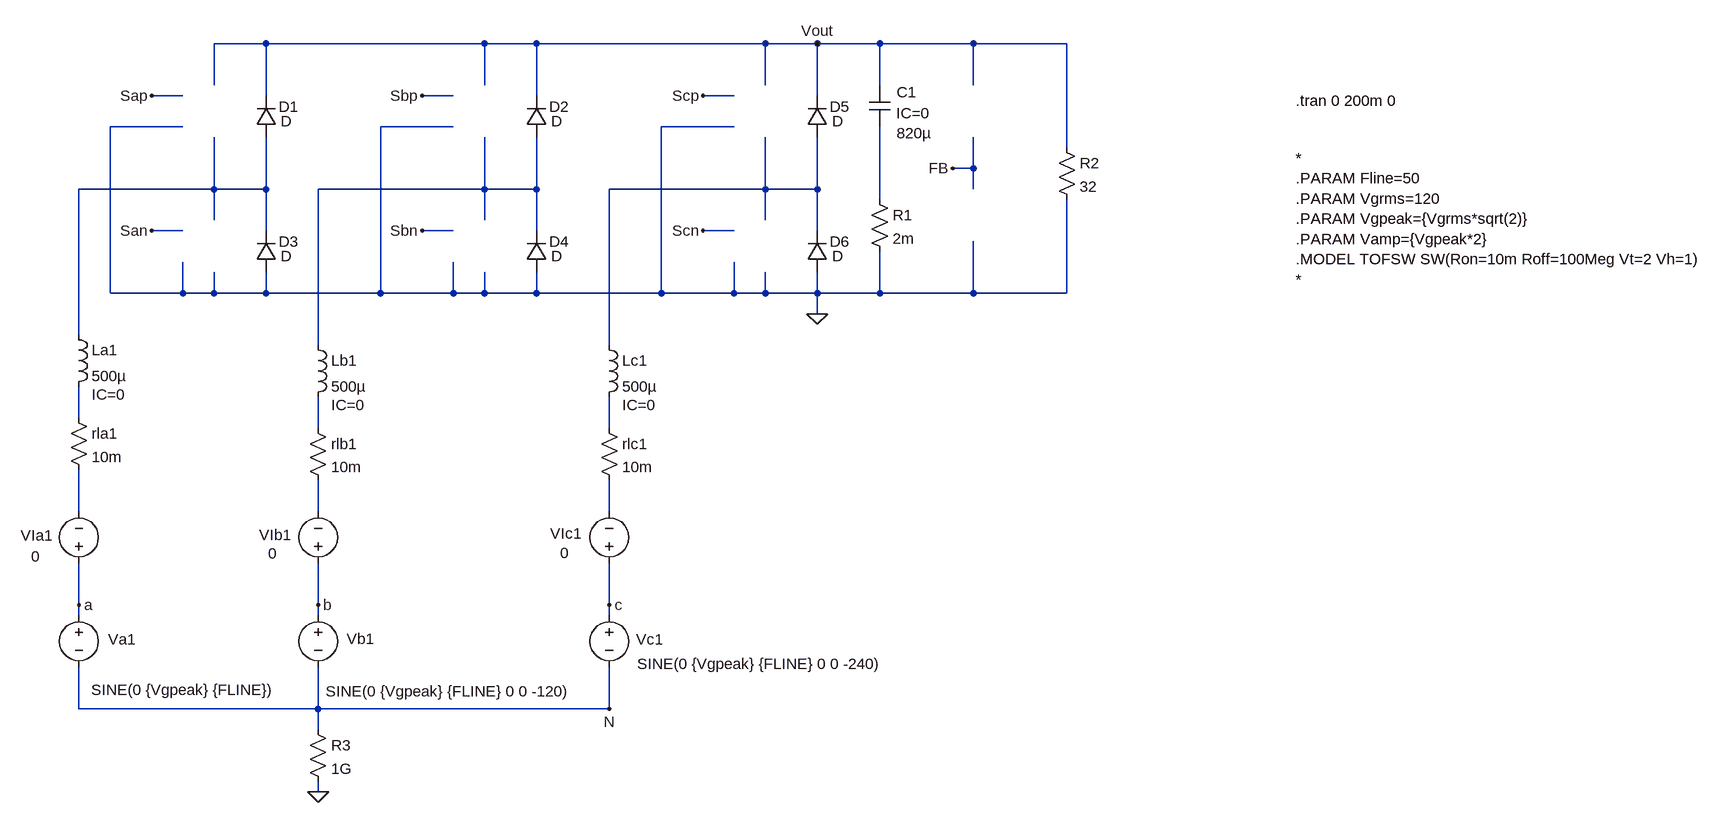
[diagram p0: schematic test 3P rect.asc]
test 3P rect.asc, the LTspice schematic file:
Version 4
SHEET 1 2280 1156
WIRE 32 -16 -48 -16
WIRE 368 -16 32 -16
WIRE 448 -16 368 -16
WIRE 800 -16 448 -16
WIRE 880 -16 800 -16
WIRE 976 -16 880 -16
WIRE 1120 -16 976 -16
WIRE 1264 -16 1120 -16
WIRE -48 48 -48 -16
WIRE 368 48 368 -16
WIRE 800 48 800 -16
WIRE 976 48 976 -16
WIRE 1120 48 1120 -16
WIRE -96 64 -144 64
WIRE 32 64 32 -16
WIRE 320 64 272 64
WIRE 448 64 448 -16
WIRE 752 64 704 64
WIRE 880 64 880 -16
WIRE -96 112 -208 112
WIRE 320 112 208 112
WIRE 752 112 640 112
WIRE 1264 144 1264 -16
WIRE 1120 176 1120 128
WIRE 1120 176 1088 176
WIRE -48 208 -48 128
WIRE -48 208 -256 208
WIRE 32 208 32 128
WIRE 32 208 -48 208
WIRE 368 208 368 128
WIRE 368 208 112 208
WIRE 448 208 448 128
WIRE 448 208 368 208
WIRE 800 208 800 128
WIRE 800 208 560 208
WIRE 880 208 880 128
WIRE 880 208 800 208
WIRE 1120 208 1120 176
WIRE 976 224 976 112
WIRE -48 256 -48 208
WIRE 368 256 368 208
WIRE 800 256 800 208
WIRE -96 272 -144 272
WIRE 32 272 32 208
WIRE 320 272 272 272
WIRE 448 272 448 208
WIRE 752 272 704 272
WIRE 880 272 880 208
WIRE -208 368 -208 112
WIRE -96 368 -96 320
WIRE -96 368 -208 368
WIRE -48 368 -48 336
WIRE -48 368 -96 368
WIRE 32 368 32 336
WIRE 32 368 -48 368
WIRE 208 368 208 112
WIRE 208 368 32 368
WIRE 320 368 320 320
WIRE 320 368 208 368
WIRE 368 368 368 336
WIRE 368 368 320 368
WIRE 448 368 448 336
WIRE 448 368 368 368
WIRE 640 368 640 112
WIRE 640 368 448 368
WIRE 752 368 752 320
WIRE 752 368 640 368
WIRE 800 368 800 336
WIRE 800 368 752 368
WIRE 880 368 880 336
WIRE 880 368 800 368
WIRE 976 368 976 304
WIRE 976 368 880 368
WIRE 1120 368 1120 288
WIRE 1120 368 976 368
WIRE 1264 368 1264 224
WIRE 1264 368 1120 368
WIRE 880 400 880 368
WIRE -256 432 -256 208
WIRE 112 448 112 208
WIRE 560 448 560 208
WIRE -256 560 -256 512
WIRE 112 576 112 528
WIRE 560 576 560 528
WIRE -256 704 -256 640
WIRE 112 704 112 656
WIRE 560 704 560 656
WIRE -256 848 -256 784
WIRE 112 848 112 784
WIRE 560 848 560 784
WIRE -256 864 -256 848
WIRE 112 864 112 848
WIRE 560 864 560 848
WIRE -256 1008 -256 944
WIRE 112 1008 112 944
WIRE 112 1008 -256 1008
WIRE 560 1008 560 944
WIRE 560 1008 112 1008
WIRE 112 1040 112 1008
WIRE 112 1136 112 1120
FLAG -256 848 a
FLAG 112 848 b
FLAG 560 848 c
FLAG -144 64 Sap
FLAG -144 272 San
FLAG 272 64 Sbp
FLAG 272 272 Sbn
FLAG 704 64 Scp
FLAG 704 272 Scn
FLAG 1088 176 FB
FLAG 880 -16 Vout
FLAG 560 1008 N
FLAG 880 400 0
FLAG 112 1136 0
SYMBOL voltage -256 848 R0
WINDOW 0 45 53 Left 2
WINDOW 3 19 131 Left 2
WINDOW 123 0 0 Left 0
WINDOW 39 0 0 Left 0
SYMATTR InstName Va1
SYMATTR Value SINE(0 {Vgpeak} {FLINE})
SYMBOL voltage 112 848 R0
WINDOW 0 44 52 Left 2
WINDOW 3 12 133 Left 2
WINDOW 123 0 0 Left 0
WINDOW 39 0 0 Left 0
SYMATTR InstName Vb1
SYMATTR Value SINE(0 {Vgpeak} {FLINE} 0 0 -120)
SYMBOL voltage 560 848 R0
WINDOW 0 41 53 Left 2
WINDOW 3 43 91 Left 2
WINDOW 123 0 0 Left 0
WINDOW 39 0 0 Left 0
SYMATTR InstName Vc1
SYMATTR Value SINE(0 {Vgpeak} {FLINE} 0 0 -240)
SYMBOL res -272 544 R0
SYMATTR InstName rla1
SYMATTR Value 10m
SYMBOL res 96 560 R0
SYMATTR InstName rlb1
SYMATTR Value 10m
SYMBOL res 544 560 R0
SYMATTR InstName rlc1
SYMATTR Value 10m
SYMBOL ind -272 416 R0
WINDOW 123 36 108 Left 2
SYMATTR InstName La1
SYMATTR Value 500µ
SYMATTR Value2 IC=0
SYMBOL ind 96 432 R0
WINDOW 123 36 108 Left 2
SYMATTR InstName Lb1
SYMATTR Value 500µ
SYMATTR Value2 IC=0
SYMBOL ind 544 432 R0
WINDOW 123 36 108 Left 2
SYMATTR InstName Lc1
SYMATTR Value 500µ
SYMATTR Value2 IC=0
SYMBOL voltage -256 800 R180
WINDOW 0 40 59 Left 2
WINDOW 3 60 27 Left 2
WINDOW 123 0 0 Left 0
WINDOW 39 0 0 Left 0
SYMATTR InstName VIa1
SYMATTR Value 0
SYMBOL voltage 112 800 R180
WINDOW 0 41 60 Left 2
WINDOW 3 63 31 Left 2
WINDOW 123 0 0 Left 0
WINDOW 39 0 0 Left 0
SYMATTR InstName VIb1
SYMATTR Value 0
SYMBOL voltage 560 800 R180
WINDOW 0 43 62 Left 2
WINDOW 3 62 32 Left 2
WINDOW 123 0 0 Left 0
WINDOW 39 0 0 Left 0
SYMATTR InstName VIc1
SYMATTR Value 0
SYMBOL cap 960 48 R0
WINDOW 0 42 11 Left 2
WINDOW 3 42 74 Left 2
WINDOW 123 41 43 Left 2
SYMATTR InstName C1
SYMATTR Value 820µ
SYMATTR Value2 IC=0
SYMBOL res 960 208 R0
SYMATTR InstName R1
SYMATTR Value 2m
SYMBOL res 1248 128 R0
SYMATTR InstName R2
SYMATTR Value 32
SYMBOL diode 48 128 R180
WINDOW 0 -34 47 Left 2
WINDOW 3 -24 25 Left 2
SYMATTR InstName D1
SYMBOL diode 464 128 R180
WINDOW 0 -34 47 Left 2
WINDOW 3 -24 25 Left 2
SYMATTR InstName D2
SYMBOL diode 48 336 R180
WINDOW 0 -34 47 Left 2
WINDOW 3 -24 25 Left 2
SYMATTR InstName D3
SYMBOL diode 464 336 R180
WINDOW 0 -34 47 Left 2
WINDOW 3 -24 25 Left 2
SYMATTR InstName D4
SYMBOL diode 896 128 R180
WINDOW 0 -34 47 Left 2
WINDOW 3 -24 25 Left 2
SYMATTR InstName D5
SYMBOL diode 896 336 R180
WINDOW 0 -34 47 Left 2
WINDOW 3 -24 25 Left 2
SYMATTR InstName D6
SYMBOL res 96 1024 R0
SYMATTR InstName R3
SYMATTR Value 1G
TEXT 1616 72 Left 2 !.tran 0 200m 0
TEXT 1616 160 Left 2 !*\n.PARAM Fline=50\n.PARAM Vgrms=120\n.PARAM Vgpeak={Vgrms*sqrt(2)}\n.PARAM Vamp={Vgpeak*2}\n.MODEL TOFSW SW(Ron=10m Roff=100Meg Vt=2 Vh=1)\n*

The netlist it stands for:
* test 3P rect.asc
Va1 a N SINE(0 {Vgpeak} {FLINE})
Vb1 b N SINE(0 {Vgpeak} {FLINE} 0 0 -120)
Vc1 c N SINE(0 {Vgpeak} {FLINE} 0 0 -240)
rla1 N005 N008 10m
rlb1 N006 N009 10m
rlc1 N007 N010 10m
La1 N001 N005 500µ IC=0
Lb1 N002 N006 500µ IC=0
Lc1 N003 N007 500µ IC=0
VIa1 a N008 0
VIb1 b N009 0
VIc1 c N010 0
C1 Vout N004 820µ IC=0
R1 N004 0 2m
R2 Vout 0 32
D1 N001 Vout D
D2 N002 Vout D
D3 0 N001 D
D4 0 N002 D
D5 N003 Vout D
D6 0 N003 D
R3 N 0 1G
.model D D
.lib standard.dio
.tran 0 200m 0
*
.PARAM Fline=50
.PARAM Vgrms=120
.PARAM Vgpeak={Vgrms*sqrt(2)}
.PARAM Vamp={Vgpeak*2}
.MODEL TOFSW SW(Ron=10m Roff=100Meg Vt=2 Vh=1)
*
.backanno
.end